# Altium schematic sheet ThereMightBeNoise.SchDoc: THERE MIGHT BE NOISE
size A3; DocumentNumber: 1; Revision: v1.0; SheetNumber: 1; SheetTotal: 9
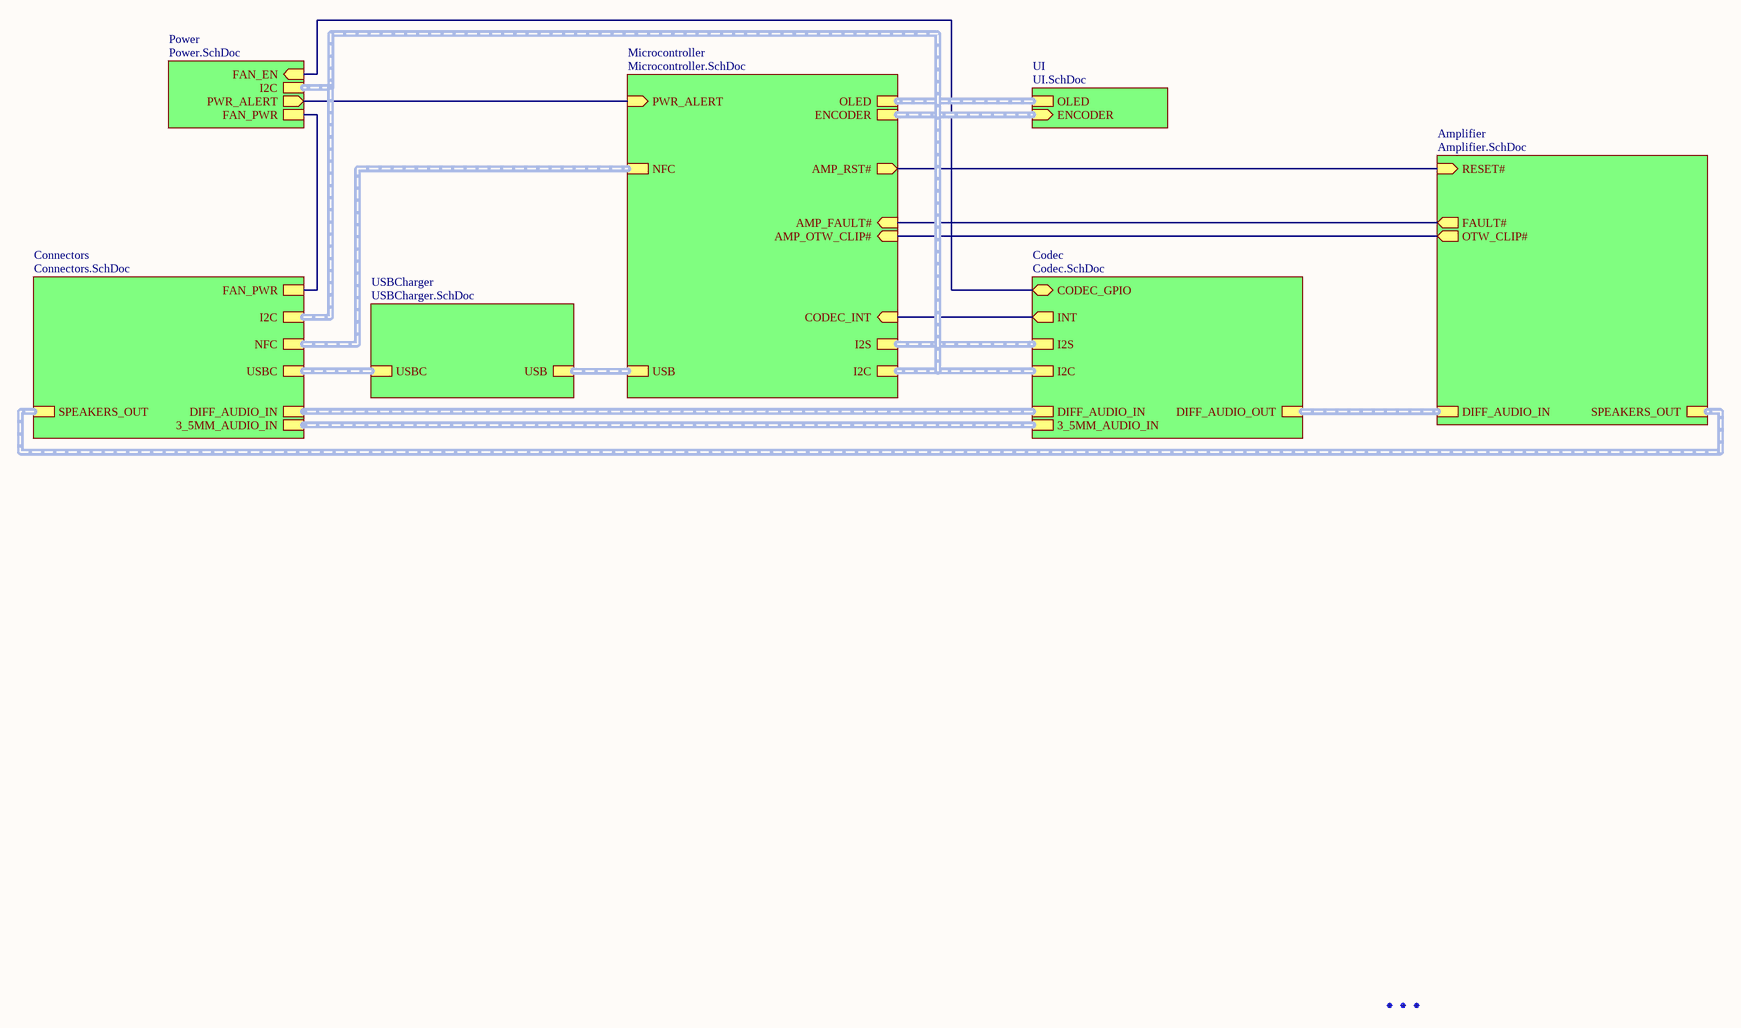
[diagram p0: ThereMightBeNoise.SchDoc]

## Parts
Fid1  Fiducial mark  [Fiducial]  (value not drawn)  (no BOM)
Fid2  Fiducial mark  [Fiducial]  (value not drawn)  (no BOM)
Fid3  Fiducial mark  [Fiducial]  (value not drawn)  (no BOM)

## Sub-sheets
Amplifier = Amplifier.SchDoc: SPEAKERS_OUT (harness DIFF_AUDIO), DIFF_AUDIO_IN (harness DIFF_AUDIO), FAULT# (out), OTW_CLIP# (out), RESET# (in)
Codec = Codec.SchDoc: DIFF_AUDIO_IN (harness DIFF_AUDIO), INT (out), DIFF_AUDIO_OUT (harness DIFF_AUDIO), I2S (harness I2S), I2C (harness I2C), 3_5MM_AUDIO_IN (harness 3_5MM_AUDIO), CODEC_GPIO (bidir)
Connectors = Connectors.SchDoc: USBC (harness USBC), DIFF_AUDIO_IN (harness DIFF_AUDIO), SPEAKERS_OUT (harness DIFF_AUDIO), 3_5MM_AUDIO_IN (harness 3_5MM_AUDIO), NFC (harness NFC), I2C (harness I2C), FAN_PWR
Microcontroller = Microcontroller.SchDoc: USB (harness USB), I2S (harness I2S), I2C (harness I2C), ENCODER (harness ENCODER), AMP_OTW_CLIP# (in), AMP_RST# (out), CODEC_INT (in), AMP_FAULT# (in), PWR_ALERT (in), NFC (harness NFC), OLED (harness OLED)
Power = Power.SchDoc: I2C (harness I2C), PWR_ALERT (out), FAN_EN (in), FAN_PWR
UI = UI.SchDoc: ENCODER (in, harness Encoder), OLED (harness OLED)
USBCharger = USBCharger.SchDoc: USBC (harness USBC), USB (harness USB)

## Nets
(unnamed): sheet Microcontroller/AMP_OTW_CLIP#, sheet Amplifier/OTW_CLIP#
(unnamed): sheet Microcontroller/AMP_RST#, sheet Amplifier/RESET#
(unnamed): sheet Microcontroller/CODEC_INT, sheet Codec/INT
(unnamed): sheet Microcontroller/AMP_FAULT#, sheet Amplifier/FAULT#
(unnamed): sheet Microcontroller/PWR_ALERT, sheet Power/PWR_ALERT
(unnamed): sheet Connectors/FAN_PWR, sheet Power/FAN_PWR
(unnamed): sheet Codec/CODEC_GPIO, sheet Power/FAN_EN

## Buses and harness runs
harness sheet Amplifier/DIFF_AUDIO_IN = sheet Codec/DIFF_AUDIO_OUT
harness sheet Amplifier/SPEAKERS_OUT = sheet Connectors/SPEAKERS_OUT
harness sheet Codec/3_5MM_AUDIO_IN = sheet Connectors/3_5MM_AUDIO_IN
harness sheet Codec/DIFF_AUDIO_IN = sheet Connectors/DIFF_AUDIO_IN
harness sheet Codec/I2C = sheet Connectors/I2C = sheet Microcontroller/I2C = sheet Power/I2C
harness sheet Codec/I2S = sheet Microcontroller/I2S
harness sheet Connectors/NFC = sheet Microcontroller/NFC
harness sheet Connectors/USBC = sheet USBCharger/USBC
harness sheet Microcontroller/ENCODER = sheet UI/ENCODER
harness sheet Microcontroller/OLED = sheet UI/OLED
harness sheet Microcontroller/USB = sheet USBCharger/USB

## Notes on the sheet
- Title
- Date:
- Number:
- Revision:
- Sheet
- of
- File:
- Author

## Library data of the parts
Fid1-Fid3 = Fid-Mark